# Altium schematic sheet M48+ EX.SchDoc
size A4
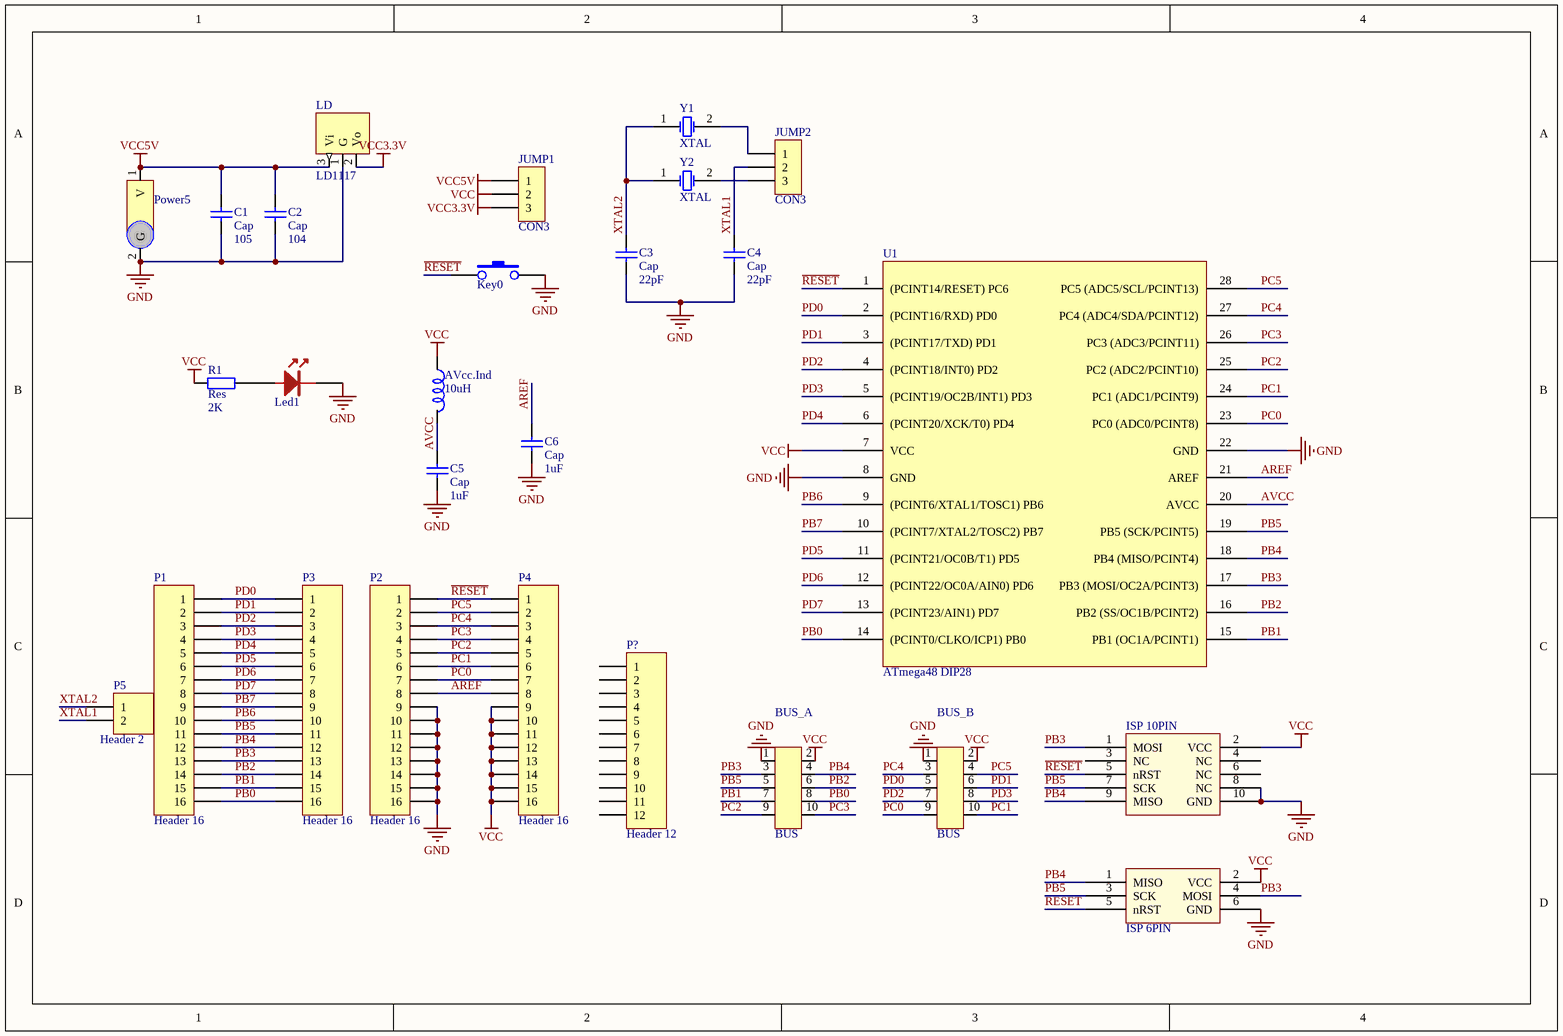
[diagram p0: M48+ EX.SchDoc]

## Parts
AVcc.Ind  10uH  [RES]
BUS_A  BUS  [ISP_10]
BUS_B  BUS  [ISP_10]
C1  Cap  value 105  [0805]
C2  Cap  value 104  [0805]
C3  Cap  value 22pF  [0603]
C4  Cap  value 22pF  [0603]
C5  Cap  value 1uF  [0805]
C6  Cap  value 1uF  [0805]
ISP_6PIN  ISP 6PIN  [ISP_6]  (value not drawn)
ISP_10PIN  ISP 10PIN  [ISP_10]  (value not drawn)
JUMP1  CON3  [SIP3]
JUMP2  CON3  [SIP3]
Key0  PB2  [KEY]  (value not drawn)
LD  LD1117  [LD1117-3.3]
Led1  Led1  [0805_LED]  (value not drawn)
P1  Header 16  [SIP16]
P2  Header 16  [SIP16]
P3  Header 16  [SIP16]
P4  Header 16  [SIP16]
P5  Header 2  [SIP2]
P?  Header 12  [SIP12]
Power5  5V  [PWR_5V]  (value not drawn)
R1  Res  value 2K  [0603]
U1  ATmega48 DIP28  [DIP28 3M]
Y1  XTAL  [CRYSTAL]
Y2  XTAL  [CRYSTAL2]

## Nets
GND: BUS_A.1 BUS_B.1 C1.1 C2.1 C3.1 C4.1 C5.1 C6.1 ISP_6PIN.6(GND) ISP_10PIN.8(NC) ISP_10PIN.10(GND) Key0.2 LD.1(G) Led1.2 P2.9 P2.10 P2.11 P2.12 P2.13 P2.14 P2.15 P2.16 Power5.2(G) U1.8(GND) U1.22(GND)
VCC: AVcc.Ind.1 BUS_A.2 BUS_B.2 ISP_6PIN.2(VCC) ISP_10PIN.2(VCC) JUMP1.2 P4.9 P4.10 P4.11 P4.12 P4.13 P4.14 P4.15 P4.16 R1.2 U1.7(VCC)
VCC3.3V: JUMP1.3 LD.2(Vo)
VCC5V: C1.2 C2.2 JUMP1.1 LD.3(Vi) Power5.1(V)
AREF: C6.2 P2.8 P4.8 U1.21(AREF)
AVCC: AVcc.Ind.2 C5.2 U1.20(AVCC)
PB0: BUS_A.8 P1.16 P3.16 U1.14((PCINT0/CLKO/ICP1)_PB0)
PB1: BUS_A.7 P1.15 P3.15 U1.15(PB1_(OC1A/PCINT1))
PB2: BUS_A.6 P1.14 P3.14 U1.16(PB2_(SS/OC1B/PCINT2))
PB3: BUS_A.3 ISP_6PIN.4(MOSI) ISP_10PIN.1(MOSI) P1.13 P3.13 U1.17(PB3_(MOSI/OC2A/PCINT3))
PB4: BUS_A.4 ISP_6PIN.1(MISO) ISP_10PIN.9(MISO) P1.12 P3.12 U1.18(PB4_(MISO/PCINT4))
PB5: BUS_A.5 ISP_6PIN.3(SCK) ISP_10PIN.7(SCK) P1.11 P3.11 U1.19(PB5_(SCK/PCINT5))
PB6: P1.10 P3.10 U1.9((PCINT6/XTAL1/TOSC1)_PB6)
PB7: P1.9 P3.9 U1.10((PCINT7/XTAL2/TOSC2)_PB7)
PC0: BUS_B.9 P2.7 P4.7 U1.23(PC0_(ADC0/PCINT8))
PC1: BUS_B.10 P2.6 P4.6 U1.24(PC1_(ADC1/PCINT9))
PC2: BUS_A.9 P2.5 P4.5 U1.25(PC2_(ADC2/PCINT10))
PC3: BUS_A.10 P2.4 P4.4 U1.26(PC3_(ADC3/PCINT11))
PC4: BUS_B.3 P2.3 P4.3 U1.27(PC4_(ADC4/SDA/PCINT12))
PC5: BUS_B.4 P2.2 P4.2 U1.28(PC5_(ADC5/SCL/PCINT13))
PD0: BUS_B.5 P1.1 P3.1 U1.2((PCINT16/RXD)_PD0)
PD1: BUS_B.6 P1.2 P3.2 U1.3((PCINT17/TXD)_PD1)
PD2: BUS_B.7 P1.3 P3.3 U1.4((PCINT18/INT0)_PD2)
PD3: BUS_B.8 P1.4 P3.4 U1.5((PCINT19/OC2B/INT1)_PD3)
PD4: P1.5 P3.5 U1.6((PCINT20/XCK/T0)_PD4)
PD5: P1.6 P3.6 U1.11((PCINT21/OC0B/T1)_PD5)
PD6: P1.7 P3.7 U1.12((PCINT22/OC0A/AIN0)_PD6)
PD7: P1.8 P3.8 U1.13((PCINT23/AIN1)_PD7)
~{RESET}: ISP_6PIN.5(nRST) ISP_10PIN.5(nRST) Key0.1 P2.1 P4.1 U1.1((PCINT14/RESET)_PC6)
XTAL1: C4.2 JUMP2.2 P5.2
XTAL2: C3.2 P5.1 Y1.1(OSC1) Y2.1(OSC1)
NetJUMP2_1: JUMP2.1 Y1.2(OSC2)
NetJUMP2_3: JUMP2.3 Y2.2(OSC2)
NetLed1_1: Led1.1 R1.1

Not connected (* = marked no-connect by the designer): ISP_10PIN 3(NC) 4(NC) 6(NC); P? 1 2 3 4 5 6 7 8 9 10 11 12

## Library data of the parts
AVcc.Ind = IND
BUS_A BUS_B = ISP_10
C1-C6 = Cap: Capacitor; Published: 8-Jun-2000; LatestRevisionDate: 17-Jul-2002; LatestRevisionNote: Re-released for DXP Platform.; PackageReference: RAD-0.3; Publisher: Altium Limited
JUMP1 JUMP2 = CON3: Connector
Key0 = KEY
Led1 = LED
P1-P4 = Header 16: Header, 16-Pin; LatestRevisionDate: 17-Jul-2002; LatestRevisionNote: Re-released for DXP Platform.; Publisher: Altium Limited
P5 = Header 2: Header, 2-Pin; LatestRevisionDate: 17-Jul-2002; LatestRevisionNote: Re-released for DXP Platform.; Publisher: Altium Limited
P? = Header 12: Header, 12-Pin; LatestRevisionDate: 17-Jul-2002; LatestRevisionNote: Re-released for DXP Platform.; Publisher: Altium Limited
Power5 = Power5
R1 = Res2: Resistor; Published: 8-Jun-2000; LatestRevisionDate: 17-Jul-2002; LatestRevisionNote: Re-released for DXP Platform.; PackageReference: AXIAL-0.4; Publisher: Altium Limited
Y1 Y2 = XTAL: Crystal Oscillator; Published: 8-Jun-2000; LatestRevisionDate: 17-Jul-2002; LatestRevisionNote: Re-released for DXP Platform.; PackageReference: R38; Publisher: Altium Limited